# Altium schematic sheet OMD_CAN.SchDoc
size A4; Organization: Altium Limited; Address1: L3, 12a Rodborough Rd; Address2: Frenchs Forest; Address3: NSW; Address4: Australia 2086
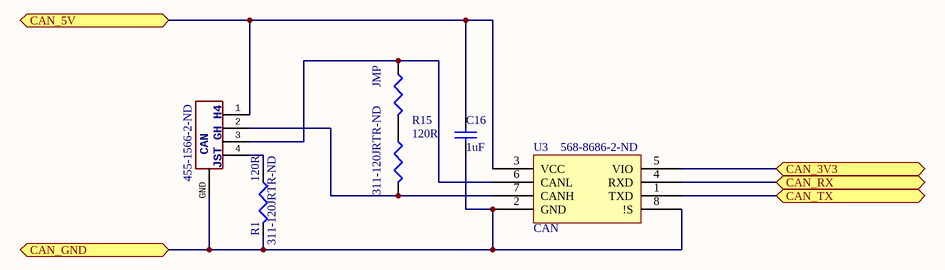
[diagram p0: OMD_CAN.SchDoc]

## Parts
C16  value 1uF  [CAPC1005L]  (hidden comment: Cap)
CAN  JST_GH_H4  Supplier Part Number 1: 455-1566-2-ND  [JST_GH_H4]
JMP  solder  [R0402]  (value not drawn)  (no BOM)
R1  value 120R  Supplier Part Number 1: 311-120JRTR-ND  [R0402]  (hidden comment: RES SMD 120 OHM 5% 1/16W 0402)
R15  value 120R  Supplier Part Number 1: 311-120JRTR-ND  [R0402]  (hidden comment: RES SMD 120 OHM 5% 1/16W 0402)
U3  CAN  Supplier Part Number 1: 568-8686-2-ND  [SON65P300X100_HS-9N]

## Ports
CAN_3V3, CAN_5V, CAN_GND, CAN_RX, CAN_TX

## Nets
CAN_3V3: U3.5(VIO) ; port CAN_3V3
CAN_5V: C16.2 CAN.1 U3.3(VCC) ; port CAN_5V
CAN_GND: C16.1 CAN.GND R1.2 U3.2(GND) U3.8(!S) ; port CAN_GND
CAN_RX: U3.4(RXD) ; port CAN_RX
CAN_TX: U3.1(TXD) ; port CAN_TX
NetCAN_2: CAN.2 R15.2 U3.7(CANH)
NetCAN_3: CAN.3 JMP.1 U3.6(CANL)
NetCAN_4: CAN.4 R1.1
NetJMP_2: JMP.2 R15.1

## Notes on the sheet
- https://github.com/OpenMotorDrive
- https://creativecommons.org/licenses/by-nc-sa/4.0/
- For Commercial use, please contact ProfiCNC
- Title
- Size:
- Date:
- A4
- Number:
- Time:
- Revision:
- Sheet
- of
- ProfiCNC Pty. Ltd.
- ProfiCNC does NOT guaranty these drawings as fit for any purpose, you must verify this information before attempting to use it in any way.  USE AT OWN RISK
- File:

## Library data of the parts
C16 = Cap: CAP CER 1UF 6.3V X5R 0402; Supplier 1: Digi-Key; Supplier Part Number 1: 587-3766-1-ND
CAN = JST_GH_H4: SM04B-GHS-TB; Supplier 1: Digi-Key
JMP R1 R15 = Resistor
  R1 R15: Supplier 1: Digi-Key
U3 = CAN: Supplier 1: Digi-Key